# Altium schematic sheet sla2216-comp.SchDoc
size A4; DocumentNumber: 2; SheetNumber: 2; SheetTotal: 6
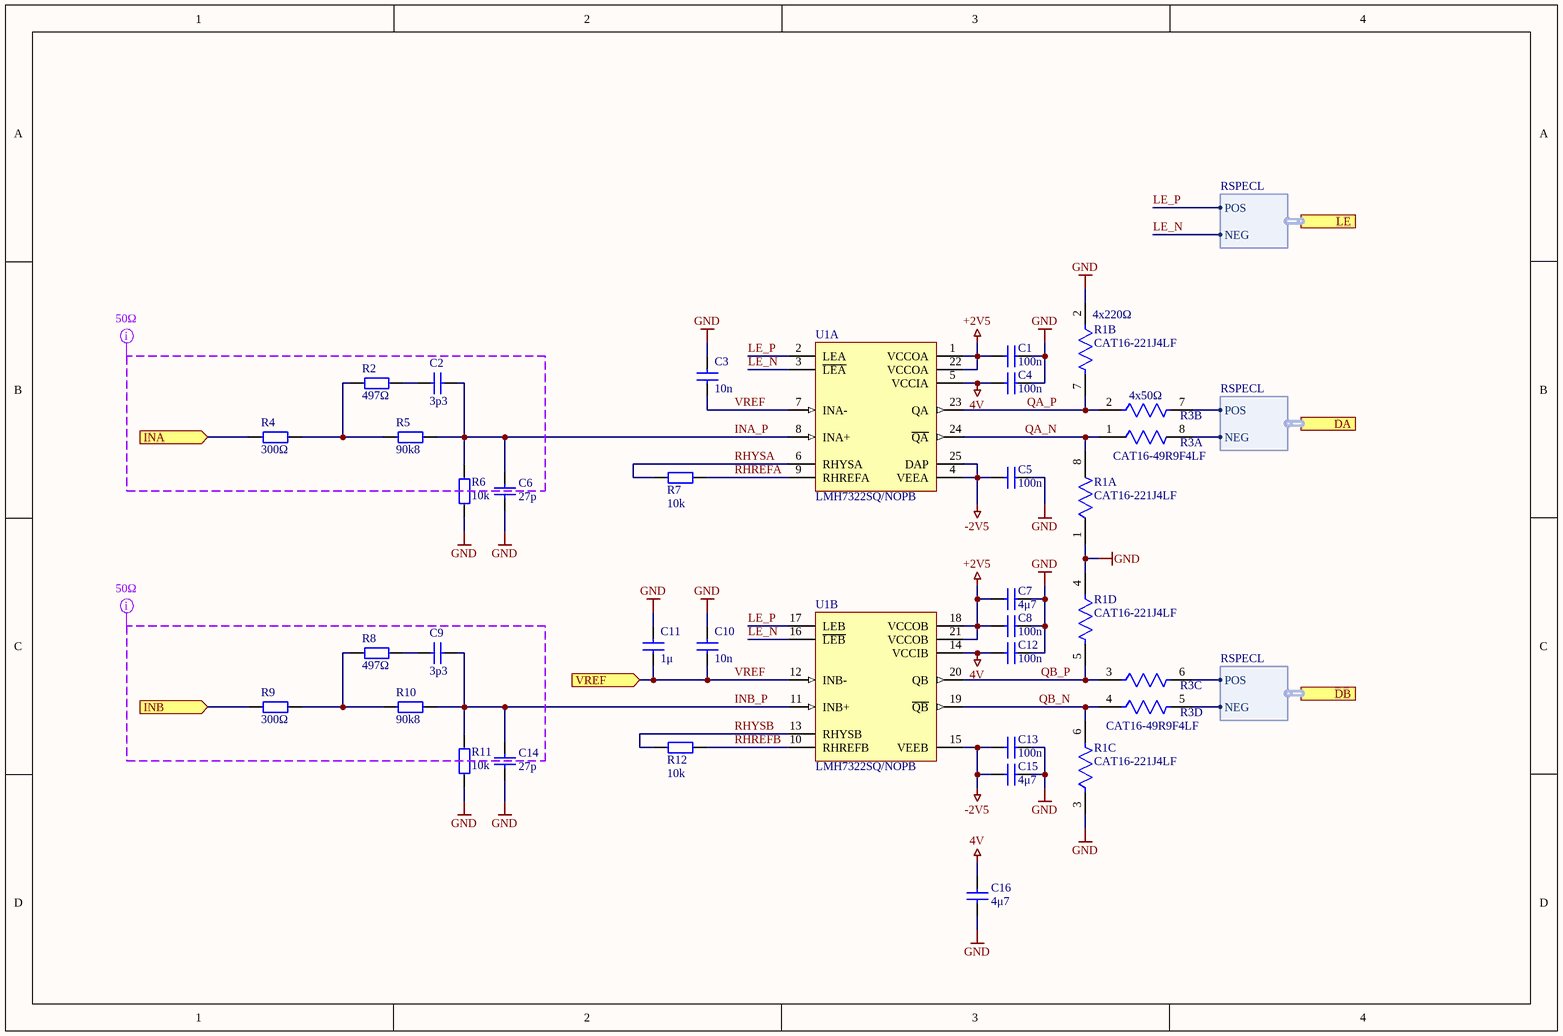
[diagram p0: sla2216-comp.SchDoc]

## Parts
C1  Capacitance: 100n  [CAP 0402/1005]
C2  Capacitance: 3p3  [CAP 0402/1005]
C3  Capacitance: 10n  [CAP 0402/1005]
C4  Capacitance: 100n  [CAP 0402/1005]
C5  Capacitance: 100n  [CAP 0402/1005]
C6  Capacitance: 27p  [CAP 0402/1005]
C7  Capacitance: 4μ7  [CAP 0603/1608]
C8  Capacitance: 100n  [CAP 0402/1005]
C9  Capacitance: 3p3  [CAP 0402/1005]
C10  Capacitance: 10n  [CAP 0402/1005]
C11  Capacitance: 1μ  [CAP 0603/1608]
C12  Capacitance: 100n  [CAP 0402/1005]
C13  Capacitance: 100n  [CAP 0402/1005]
C14  Capacitance: 27p  [CAP 0402/1005]
C15  Capacitance: 4μ7  [CAP 0603/1608]
C16  Capacitance: 4μ7  [CAP 0603/1608]
R1  CAT16-221J4LF  [FP-CAT16-F4-MFG]  (parts A,B,C,D of 4)
R2  Resistance: 497Ω  [RES 0402/1005]
R3  CAT16-49R9F4LF  [FP-CAT16-F4-MFG]  (parts A,B,C,D of 4)
R4  Resistance: 300Ω  [RES 0805/2012]
R5  Resistance: 90k8  [RES 0402/1005]
R6  Resistance: 10k  [RES 0402/1005]
R7  Resistance: 10k  [RES 0402/1005]
R8  Resistance: 497Ω  [RES 0402/1005]
R9  Resistance: 300Ω  [RES 0805/2012]
R10  Resistance: 90k8  [RES 0402/1005]
R11  Resistance: 10k  [RES 0402/1005]
R12  Resistance: 10k  [RES 0402/1005]
U1  LMH7322SQ/NOPB  [RTW0024A_V]  (parts A,B of 2)

## Ports
DA (harness RSPECL), DB (harness RSPECL), INA (in), INB (in), LE (harness RSPECL), VREF (in)

## Harnesses
RSPECL: POS, NEG

## Nets
4V: C4.2 C12.2 C16.2 U1.5(VCCIA) U1.14(VCCIB)
+2V5: C1.2 C7.1 C8.2 U1.1(VCCOA) U1.18(VCCOB) U1.21(VCCOB) U1.22(VCCOA)
-2V5: C5.2 C13.2 C15.1 U1.4(VEEA) U1.15(VEEB) U1.25(DAP)
GND: C1.1 C3.1 C4.1 C5.1 C6.2 C7.2 C8.1 C10.1 C11.2 C12.1 C13.1 C14.2 C15.2 C16.1 R1.1 R1.2 R1.3 R1.4 R6.2 R11.2
INA: R4.1 ; port INA
INA_P: C2.2 C6.1 R5.2 R6.1 U1.8(INA+)
INB: R9.1 ; port INB
INB_P: C9.2 C14.1 R10.2 R11.1 U1.11(INB+)
LE_N: U1.3(~{LEA}) U1.16(~{LEB}) ; port LE.NEG
LE_P: U1.2(LEA) U1.17(LEB) ; port LE.POS
QA_N: R1.8 R3.1 U1.24(~{QA})
QA_P: R1.7 R3.2 U1.23(QA)
QB_N: R1.6 R3.4 U1.19(~{QB})
QB_P: R1.5 R3.3 U1.20(QB)
RHREFA: R7.1 U1.9(RHREFA)
RHREFB: R12.1 U1.10(RHREFB)
RHYSA: R7.2 U1.6(RHYSA)
RHYSB: R12.2 U1.13(RHYSB)
VREF: C3.2 C10.2 C11.1 U1.7(INA-) U1.12(INB-) ; port VREF
NetC2_1: C2.1 R2.2
NetC9_1: C9.1 R8.2
NetR2_1: R2.1 R4.2 R5.1
NetR3_5: R3.5 ; port DB.NEG
NetR3_6: R3.6 ; port DB.POS
NetR3_7: R3.7 ; port DA.POS
NetR3_8: R3.8 ; port DA.NEG
NetR8_1: R8.1 R9.2 R10.1

## Layout directives
net class 50_OHM: (no net found under the mark)

## Notes on the sheet
- (near R1) 4x220Ω
- (near R3) 4x50Ω

## Library data of the parts
C1 C4 C5 C8 C12 C13 = Capacitor: Ceramic Capacitor; Rated Voltage: 10V; BOMref: CAPC_100n_10%_10V_X7R_0402; Dielectric: X7R; Tolerance: 10%; Package: 0402
C2 C9 = Capacitor: Ceramic Capacitor; Rated Voltage: 16V; BOMref: CAPC_3p3_10%_16V_C0G_0402; Dielectric: C0G; Tolerance: 10%; Package: 0402
C3 C10 = Capacitor: Ceramic Capacitor; Rated Voltage: 10V; BOMref: CAPC_10n_10%_10V_X7R_0402; Dielectric: X7R; Tolerance: 10%; Package: 0402
C6 C14 = Capacitor: Ceramic Capacitor; Rated Voltage: 16V; BOMref: CAPC_27p_10%_16V_C0G_0402; Dielectric: C0G; Tolerance: 10%; Package: 0402
C7 C15 C16 = Capacitor: Ceramic Capacitor; Rated Voltage: 6V3; BOMref: CAPC_4μ7_10%_6V3_X7R_0603; Dielectric: X7R; Tolerance: 10%; Package: 0603
C11 = Capacitor: Ceramic Capacitor; Rated Voltage: 6V3; BOMref: CAPC_1μ_10%_6V3_X7R_0603; Dielectric: X7R; Tolerance: 10%; Package: 0603
R1 = CMP-07230-000005-1: RES ARRAY 4 RES 220 OHM 1206; Resistance: 49.9R; Temperature Coefficient: 200ppm/°C; Voltage Rating: 50V; Power Per Element: 62.5mW; Circuit Type: Isolated; Number of Resistors: 4; Power Rating: 248mW; Tolerance: 1%; Lead Pitch: 0.8mm; Max Operating Temperature: 125°C; Width: 0.063inch; Voltage Rating (DC): 50V; Number of Pins: 8; Depth: 1.6mm; REACH SVHC: No SVHC; Length: 3.2mm; Terminal Pitch: 0.8mm; Case Code (Metric): 3216; Radiation Hardening: No; Min Operating Temperature: -55°C; Packaging: Tape and Reel; Number of Terminals: 8; Military Standard: Not; Height: 0.024inch; Mount: Surface Mount; Termination: Concave; Package Quantity: 1; Number of Elements: 4; Case/Package: 1206; Case Code (Imperial): 1206
R2 R8 = Resistor: BOMref: RES_497Ω_5%_50V_0402; Tolerance: 5%; Voltage Rating: 50V; Package: 0402
R3 = CMP-07230-000005-1: RES ARRAY 4 RES 49.9 OHM 1206; Resistance: 49.9R; Temperature Coefficient: 200ppm/°C; Voltage Rating: 50V; Power Per Element: 62.5mW; Circuit Type: Isolated; Number of Resistors: 4; Power Rating: 248mW; Tolerance: 1%; Lead Pitch: 0.8mm; Max Operating Temperature: 125°C; Width: 0.063inch; Voltage Rating (DC): 50V; Number of Pins: 8; Depth: 1.6mm; REACH SVHC: No SVHC; Length: 3.2mm; Terminal Pitch: 0.8mm; Case Code (Metric): 3216; Radiation Hardening: No; Min Operating Temperature: -55°C; Packaging: Tape and Reel; Number of Terminals: 8; Military Standard: Not; Height: 0.024inch; Mount: Surface Mount; Termination: Concave; Package Quantity: 1; Number of Elements: 4; Case/Package: 1206; Case Code (Imperial): 1206
R4 R9 = Resistor: BOMref: RES_300Ω_5%_50V_0805; Tolerance: 5%; Voltage Rating: 50V; Package: 0805
R5 R10 = Resistor: BOMref: RES_90k8_5%_50V_0402; Tolerance: 5%; Voltage Rating: 50V; Package: 0402
R6 R7 R11 R12 = Resistor: BOMref: RES_10k_5%_50V_0402; Tolerance: 5%; Voltage Rating: 50V; Package: 0402
U1 = CMP-0055-00284-3: Dual 700 ps High Speed Comparator with RSPECL Outputs, 24-pin LLP, Pb-Free; Manufacturer: Texas Instruments; CompType: Amplifiers; PackageTopMarking: NS*UZXYTT*L7322SQ; PowerWise: Y; ComponentLink1Description: Datasheet URL; ComponentLink1URL: http://www.ti.com/general/docs/lit/getliterature.tsp?genericPartNumber=LMH7322&fileType=pdf; Code_JEDEC: MO-220-WGGD-6; RoHS: Y; PinCount: 24; Package Reference: RTW0024A; PackageDescription: LLP, Plastic, Quad, 4 x 4 x 0.8mm Body, 24 Lead, 0.5mm Pitch, No Pullback